# Altium project PIC12F675_prt.PrjPcb
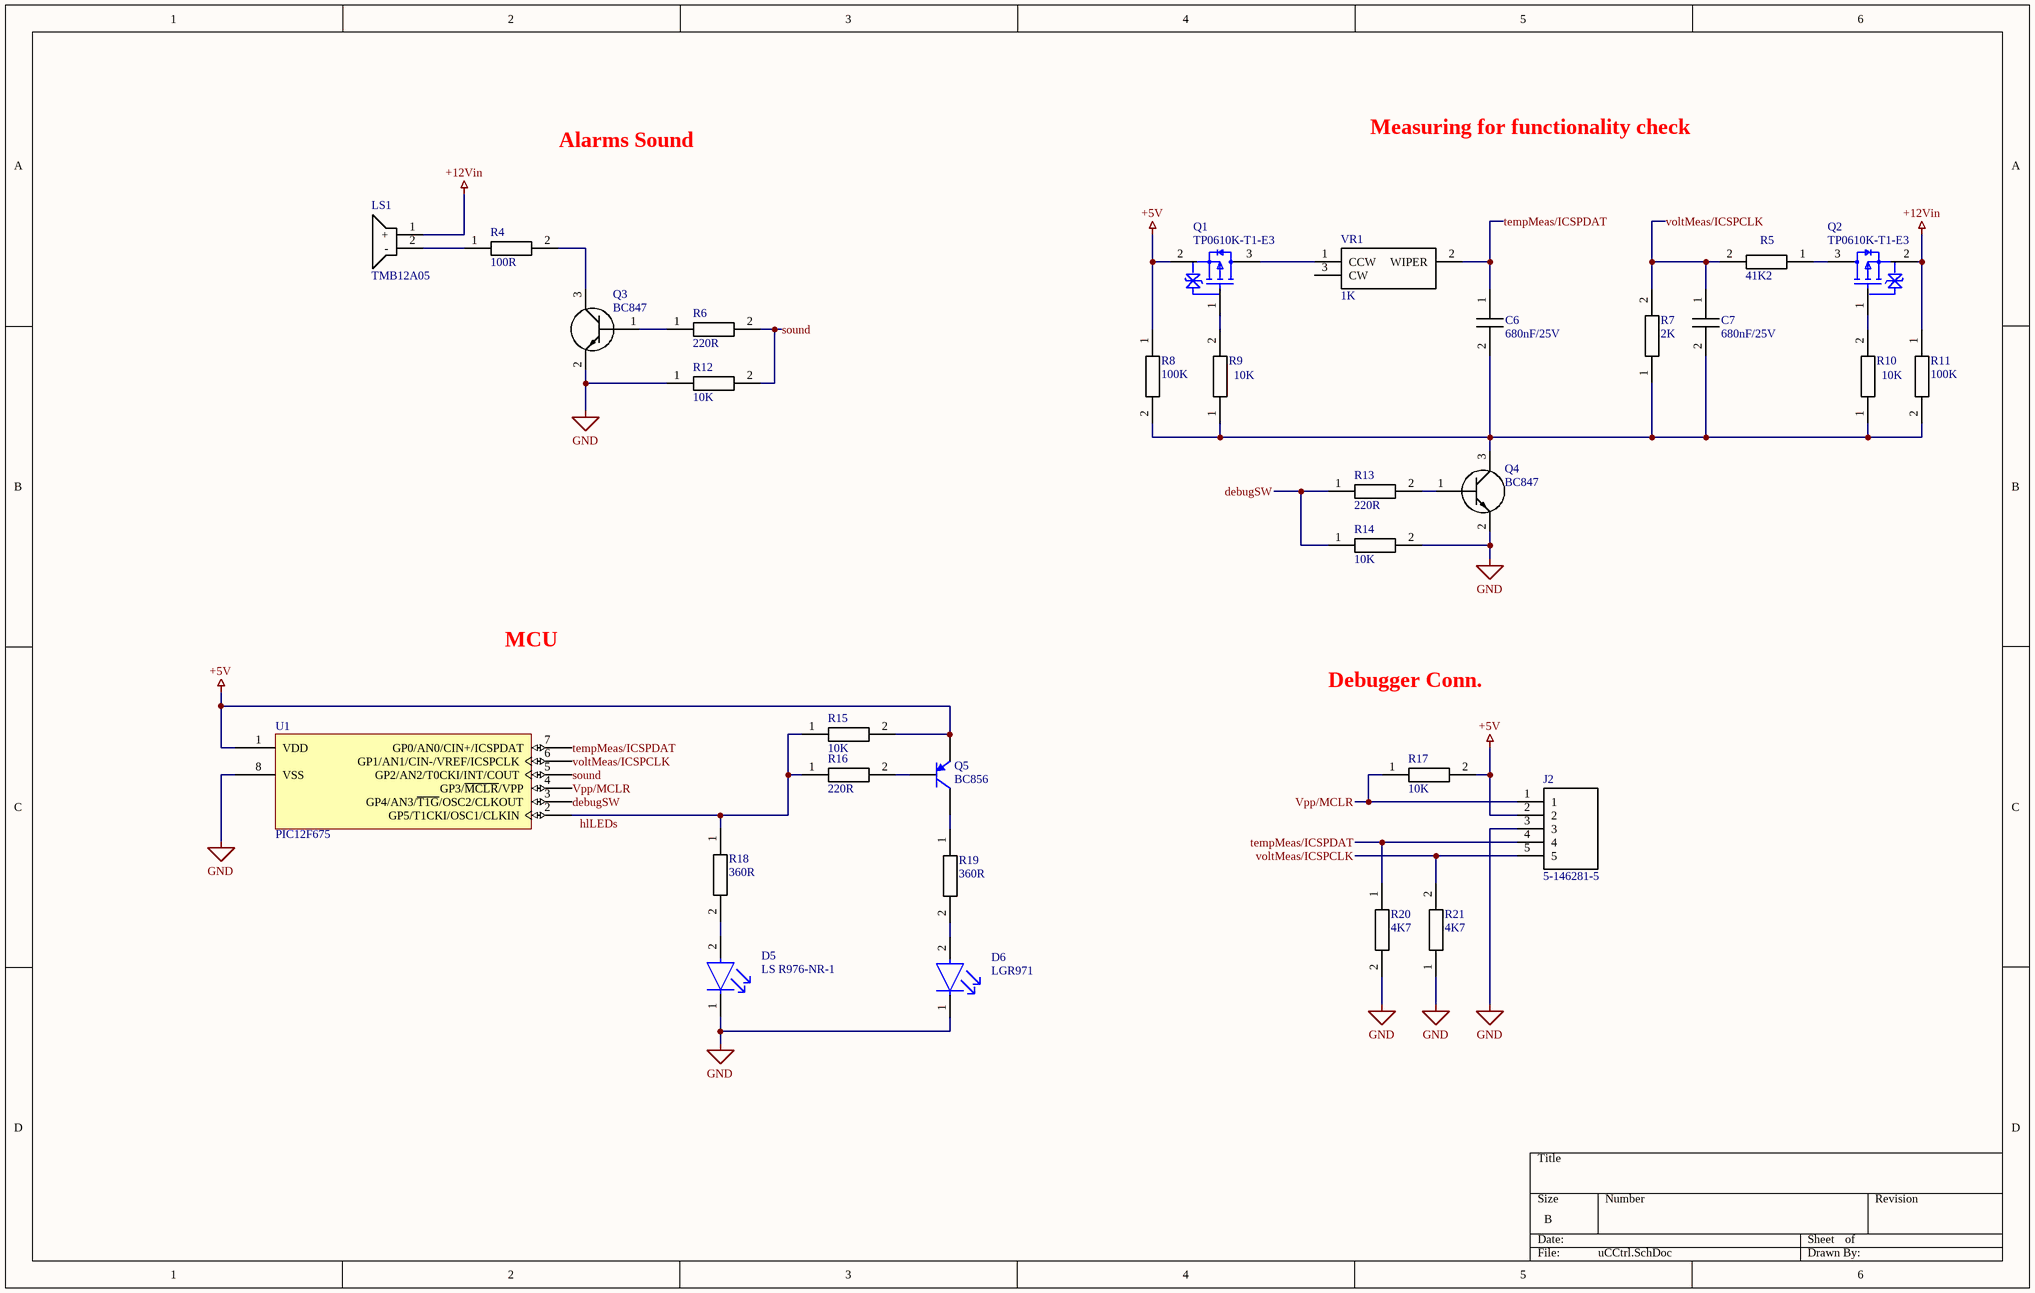
[diagram p0: uCCtrl.SchDoc]
2 sheets, 87 parts. Net scope: global (net labels, ports and power ports of the same name join across sheets).
Board file: Prototype v2.PcbDoc
Sheets:
  uCCtrl.SchDoc
  Filter.SchDoc

## Sheet uCCtrl.SchDoc
size B

### Parts
C6  680nF/25V  [CAPC2012X95N]
C7  680nF/25V  [CAPC2012X95N]
D5  LS R976-NR-1  [FP-LS_R976-MFG]
D6  LGR971  [FP-LG_R971-MFG]
J2  5-146281-5  [HDRV5W67P0X254_1X5_1229X234X821P]
LS1  TMB12A05  [TMB12A05]
Q1  TP0610K-T1-E3  [FP-S-03946-MFG]
Q2  TP0610K-T1-E3  [FP-S-03946-MFG]
Q3  BC847  [BC847215]
Q4  BC847  [BC847215]
Q5  BC856  [NXP-SOT23-3_V]
R4  100R  [RESC2012X60N]
R5  41K2  [RESC2012X65N]
R6  220R  [RESC2012X65N]
R7  2K  [RESC2012X65N]
R8  100K  [RESC2012X65N]
R9  10K  [RESC2012X65N]
R10  10K  [RESC2012X65N]
R11  100K  [RESC2012X65N]
R12  10K  [RESC2012X65N]
R13  220R  [RESC2012X65N]
R14  10K  [RESC2012X65N]
R15  10K  [RESC2012X65N]
R16  220R  [RESC2012X65N]
R17  10K  [RESC2012X65N]
R18  360R  [RESC2012X65N]
R19  360R  [RESC2012X65N]
R20  4K7  [RESC2012X65N]
R21  4K7  [RESC2012X65N]
U1  PIC12F675  [PDIP300-P8]
VR1  1K  [23SR1KLFTR]

### Nets
+5V: J2.2 Q1.2(S) Q5.2(E) R8.1 R15.2 R17.2 U1.1(VDD)
+12Vin: LS1.1(+) Q2.2(S) R11.1
GND: D5.1(C) D6.1(C) J2.3 Q3.2(E) Q4.2(E) R12.1 R14.2 R20.2 R21.1 U1.8(VSS)
debugSW: R13.1 R14.1 U1.3(GP4/AN3/~{T1G}/OSC2/CLKOUT)
hlLEDs: R15.1 R16.1 R18.1 U1.2(GP5/T1CKI/OSC1/CLKIN)
sound: R6.2 R12.2 U1.5(GP2/AN2/T0CKI/INT/COUT)
tempMeas/ICSPDAT: C6.1 J2.4 R20.1 U1.7(GP0/AN0/CIN+/ICSPDAT) VR1.2(WIPER)
voltMeas/ICSPCLK: C7.1 J2.5 R5.2 R7.2 R21.2 U1.6(GP1/AN1/CIN-/VREF/ICSPCLK)
Vpp/MCLR: J2.1 R17.1 U1.4(GP3/~{MCLR}/VPP)
NetC6_2: C6.2 C7.2 Q4.3(C) R7.1 R8.2 R9.1 R10.1 R11.2
NetD5_2: D5.2(A) R18.2
NetD6_2: D6.2(A) R19.2
NetLS1_2: LS1.2(-) R4.1
NetQ1_1: Q1.1(G) R9.2
NetQ1_3: Q1.3(D) VR1.1(CCW)
NetQ2_1: Q2.1(G) R10.2
NetQ2_3: Q2.3(D) R5.1
NetQ3_1: Q3.1(B) R6.1
NetQ3_3: Q3.3(C) R4.2
NetQ4_1: Q4.1(B) R13.2
NetQ5_1: Q5.1(B) R16.2
NetQ5_3: Q5.3(C) R19.1

Not connected (* = marked no-connect by the designer): VR1 3(CW)

### Notes on the sheet
- Alarms Sound
- Measuring for functionality check
- MCU
- Debugger Conn.

### Library data of the parts
C6 C7 = GRM219B31E684KA88D: Capacitor; Manufacturer_Name: Murata Electronics; Datasheet Link: http://www.murata.com/~/media/webrenewal/support/library/catalog/products/capacitor/mlcc/c02e.pdf; Height: 0.95mm; Manufacturer_Part_Number: GRM219B31E684KA88D
D5 = CMP-62016-000037-1: LED RED DIFFUSED 0805 SMD; Lens Size: 1.25mm; Number of LEDs: 1; Luminous Intensity: 180mcd; Dominant Wavelength: 633nm; Lens Style: Flat; Reverse Voltage: 12V; Lens Color: White; Forward Voltage: 2.5V; Forward Current: 25mA; Power Dissipation: 65W; Luminous Flux: 0.47lm; Test Current: 20mA; Viewing Angle: 160°; Length: 2mm; Number of Pins: 2; Lens Transparency: Diffused; Min Operating Temperature: -30°C; Case Code (Metric): 2012; Depth: 1.35mm; Color: Red; Illumination Color: Red; Max Operating Temperature: 85°C; Mount: Surface Mount; Case/Package: 0805; Height: 0.9mm; Package Quantity: 16000; Number of Elements: 1; Radiation Hardening: No; Case Code (Imperial): 0805; Packaging: Tape and Reel; Width: 1.25mm
D6 = CMP-62016-000039-1: LED GREEN DIFFUSED 0805 SMD; Test Current: 20mA; Power Dissipation: 65mW; Number of LEDs: 1; Viewing Angle: 160°; Lens Color: White; Lens Size: 1.25mm; Forward Voltage: 2.2V; Reverse Voltage: 12V; Forward Current: 25mA; Luminous Intensity: 45mcd; Luminous Flux: 0.1lm; Dominant Wavelength: 570nm; Min Operating Temperature: -30°C; Packaging: Tape and Reel; Radiation Hardening: No; Number of Pins: 2; Case Code (Imperial): 0805; Lens Style: Diffused; Mount: Surface Mount; Package Quantity: 1; Case Code (Metric): 2012; Color: Green; Case/Package: 0805; Width: 1.25mm; Illumination Color: Green; Lens Transparency: Diffused; Max Operating Temperature: 85°C; Number of Elements: 1; Depth: 1.35mm; Height: 0.9mm; Length: 2.1mm
J2 = 5-146281-5: Connector; Manufacturer_Name: TE Connectivity; Datasheet Link: https://www.te.com/commerce/DocumentDelivery/DDEController?Action=showdoc&DocId=Customer+Drawing%7F146281%7FG2%7Fpdf%7FEnglish%7FENG_CD_146281_G2.pdf%7F5-146281-5; Height: 8.21mm; Manufacturer_Part_Number: 5-146281-5; Mouser Part Number: 571-5-146281-5; Mouser Price/Stock: https://www.mouser.co.uk/ProductDetail/TE-Connectivity/5-146281-5?qs=bwpFY26eRVcDY9brDBVAcw%3D%3D; Arrow Part Number: 5-146281-5; Arrow Price/Stock: https://www.arrow.com/en/products/5-146281-5/te-connectivity?region=nac
LS1 = TMB12A05: Loudspeaker or Buzzer; Manufacturer_Name: Jiangsu Huaneng Elec; Datasheet Link: https://datasheet.lcsc.com/szlcsc/Jiangsu-Huaneng-Elec-TMB12A05_C96093.pdf; Height: 9.5mm; Manufacturer_Part_Number: TMB12A05
Q1 Q2 = CMP-02550-000129-1: MOSFET P-CH 60V 185MA SOT23-3; Manufacturer: Vishay; Drain To Source Voltage: -60V; Depletion Mode: False; Max Junction Temp: +150°C; Threshold Vgs Max: -3V; Rthja Max: 350°C/W; Max Forward Diode Voltage: -1.4V; Gate Charge At Vgs: 1.7nC @ -15V; Power Dissipation: 350mW; Turn Off Delay Time: 35ns; Number Of P Channels: 1; Standoff Height: 0.01mm; Input Capacitace At Vds: 23pF @ -25V; Gate To Source Voltage: 20V; Turn On Delay Time: 20ns; Continuous Drain Current: -185mA; Drain To Source Resistance: 6Ω; Threshold Vgs Min: -1V; Pulse Drain Current: -800mA; Temperature: -55°C to +150°C; Digikey Description: MOSFET P-CH 60V 185MA SOT23-3; Drain To Source Breakdown Voltage: -60V; Category: Trans; Temperature Range High: +150°C; Ipc Land Pattern Name: SOT95P237X100-3; Height: 1.12mm; Temperature Range Low: -55°C; Device Class L3: MOSFETs; Manufacturer Part Number: TP0610K-T1-E3; Number Of Channels: 1; ComponentLink2Description: Datasheet; RoHS: TRUE; Lead Free: Yes; Package: S-03946; Mouser Description: Mosfet; P-ch; Vdss -60V; Rds(on) 10 Ohms; Id -185MA; TO-236 (SOT-23); Pd 350MW; -55DEGC; Automotive: No; Device Class L2: Transistors; Device Class L1: Discrete Semiconductors; Octopart: https://octopart.com/tp0610k-t1-e3-vishay-40944172; ComponentLink2URL: http://www.vishay.com/docs/71411/tp0610k.pdf
Q3 Q4 = BC847,215: Transistor BJT NPN; Manufacturer_Name: Nexperia; Datasheet Link: https://assets.nexperia.com/documents/data-sheet/BC847_SER.pdf; Height: 1.1mm; Manufacturer_Part_Number: BC847,215; Mouser Part Number: 771-BC847215; Mouser Price/Stock: https://www.mouser.co.uk/ProductDetail/Nexperia/BC847215?qs=me8TqzrmIYWROhdFmDauyQ%3D%3D; Arrow Part Number: BC847,215; Arrow Price/Stock: https://www.arrow.com/en/products/bc847215/nexperia?region=nac
Q5 = CMP-2000-05936-1: PNP General Purpose Transistor, 65 V, -65 to 150 degC, 3-Pin SOT23, RoHS; Manufacturer: NXP; No. of Pins: 3; Voltage Vcbo: 80V; Power Dissipation Ptot Max: 250mW; Current Ic hFE: 2mA; Collector Emitter Voltage V(br)ceo: 65V; Hfe Min: 125; Continuous Collector Current Ic Max: 100mA; Gain Bandwidth ft Typ: 150MHz; Transistor Case Style: SOT-23; No. of Transistors: 1; Package Version: 02/2016; SMD Marking: 3D; Gain Bandwidth ft Min: 100MHz; SVHC: NoSVHC(19-Dec-2012); Noise Factor Max: 10dB; Collector Emitter Voltage Vces: -300mV; Operating Temperature Range: -65°Cto+150°C; Datasheet URL: http://www.nxp.com/documents/data_sheet/BC856_BC857_BC858.pdf; Device Marking: BC856; Mounting Technology: SurfaceMount; Package Reference: SOT23-3; Operating Temperature Max: 150°C; Package / Case: SOT-23; DC Current Gain hFE: 125; Current Ic Continuous a Max: 100mA; Power Dissipation Pd: 250mW; Manufacturer URL: http://www.nxp.com/; Termination Type: SMD; Transistor Polarity: PNP; Package URL: http://www.nxp.com/documents/outline_drawing/SOT23.pdf; DC Collector Current: 100mA; Operating Temperature Min: -65°C; Package Description: 3-Pin Small Outline Transistor, Body 1.3 x 2.9 mm, Pitch 0.95 mm; Datasheet Version: 01/2004
R4 = CRCW0805100RFKEAHP: Resistor; Manufacturer_Name: Vishay; Datasheet Link: https://componentsearchengine.com/Datasheets/1/CRCW08051R00FKEAHP.pdf; Height: 0.6mm; Manufacturer_Part_Number: CRCW0805100RFKEAHP; Mouser Part Number: 71-CRCW0805100RFKEAH; Mouser Price/Stock: https://www.mouser.co.uk/ProductDetail/Vishay-Dale/CRCW0805100RFKEAHP?qs=k2%2FDWSARqgHN0DmoUSjg4g%3D%3D; Arrow Part Number: CRCW0805100RFKEAHP; Arrow Price/Stock: https://www.arrow.com/en/products/crcw0805100rfkeahp/vishay?region=nac
R5 = CPF0805B41K2E1: Resistor; Manufacturer_Name: TE Connectivity; Datasheet Link: http://docs-europe.electrocomponents.com/webdocs/13d1/0900766b813d116f.pdf; Height: 0.65mm; Manufacturer_Part_Number: CPF0805B41K2E1
R6 R12-R16 = CPF0805B220RE: Resistor; Manufacturer_Name: TE Connectivity; Datasheet Link: http://docs-europe.electrocomponents.com/webdocs/13d1/0900766b813d116f.pdf; Height: 0.65mm; Manufacturer_Part_Number: CPF0805B220RE
R7-R11 R17-R21 = CPF0805B360RE1: Resistor; Manufacturer_Name: TE Connectivity; Datasheet Link: http://docs-europe.electrocomponents.com/webdocs/13d1/0900766b813d116f.pdf; Height: 0.65mm; Manufacturer_Part_Number: CPF0805B360RE1; Mouser Part Number: 279-CPF0805B360RE1; Mouser Price/Stock: https://www.mouser.co.uk/ProductDetail/TE-Connectivity-Holsworthy/CPF0805B360RE1?qs=iJVBkmKXgrlAzfqD%252B6zqmg%3D%3D
U1 = CMP-0190-00021-1: FLASH-Based 8-Bit CMOS Microcontroller, 10-Bit A/D, 8-Pin PDIP, Industrial Temperature; Note1: Refer to data sheet (DS41190F) for details of supply voltage range under different conditions.; DatasheetVersion: revF, Sep-2009; Code_JEDEC: MS-001; PackageVersion: revBB, Aug-2009; PackageDescription: 8-Lead Plastic Dual In-Line (P) - 300 mil Body [PDIP]; PackageReference: PDIP300-P8
VR1 = 23SR1KLFTR: Variable Resistor; Manufacturer_Name: TT Electronics; Datasheet Link: https://www.mouser.com/datasheet/2/414/23-1527241.pdf; Height: 2.73mm; Manufacturer_Part_Number: 23SR1KLFTR

## Sheet Filter.SchDoc
size B
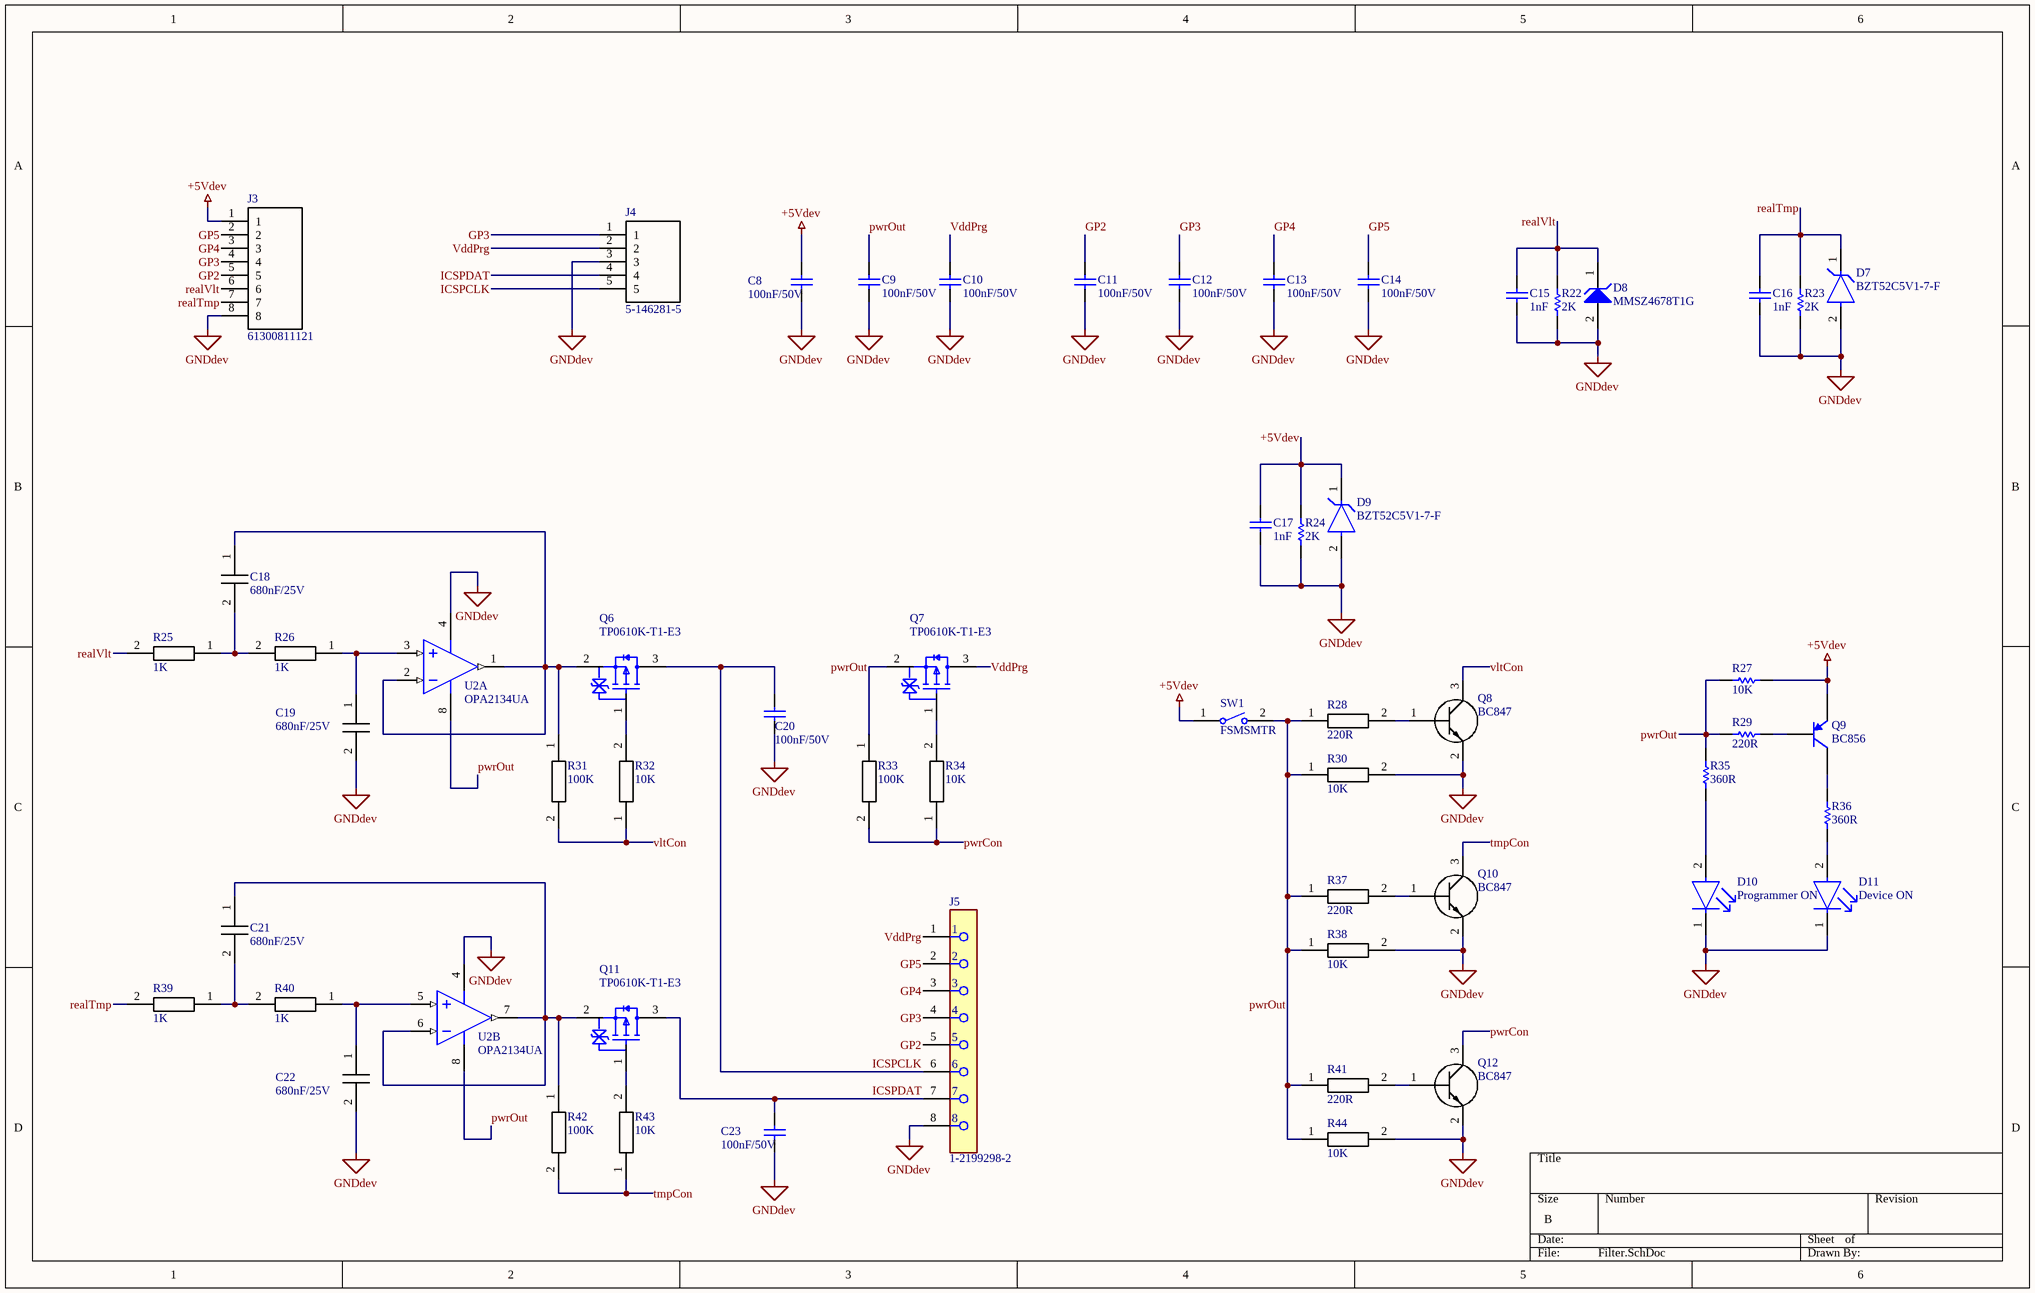
[diagram p1: Filter.SchDoc]

### Parts
C8  100nF/50V  [CAPC2013X145X48NL20T23]
C9  100nF/50V  [CAPC2013X145X48NL20T23]
C10  100nF/50V  [CAPC2013X145X48NL20T23]
C11  100nF/50V  [CAPC2013X145X48NL20T23]
C12  100nF/50V  [CAPC2013X145X48NL20T23]
C13  100nF/50V  [CAPC2013X145X48NL20T23]
C14  100nF/50V  [CAPC2013X145X48NL20T23]
C15  1nF  [CAPC2013X145X48ML20T23]
C16  1nF  [CAPC2013X145X48ML20T23]
C17  1nF  [CAPC2013X145X48ML20T23]
C18  680nF/25V  [CAPC2012X95N]
C19  680nF/25V  [CAPC2012X95N]
C20  100nF/50V  [CAPC2013X145X48NL20T23]
C21  680nF/25V  [CAPC2012X95N]
C22  680nF/25V  [CAPC2012X95N]
C23  100nF/50V  [CAPC2013X145X48NL20T23]
D7  BZT52C5V1-7-F  [FP-SOD123-MFG]
D8  MMSZ4678T1G  [ONSC-SOD-123-2-425-04_V]
D9  BZT52C5V1-7-F  [FP-SOD123-MFG]
D10  Programmer ON  [FP-LG_R971-MFG]
D11  Device ON  [FP-LS_R976-MFG]
J3  61300811121  [HDRV8W64P0X254_1X8_2032X254X854P]
J4  5-146281-5  [HDRV5W67P0X254_1X5_1229X234X821P]
J5  1-2199298-2  [FP-1-2199298-2-MFG]
Q6  TP0610K-T1-E3  [FP-S-03946-MFG]
Q7  TP0610K-T1-E3  [FP-S-03946-MFG]
Q8  BC847  [BC847215]
Q9  BC856  [NXP-SOT23-3_V]
Q10  BC847  [BC847215]
Q11  TP0610K-T1-E3  [FP-S-03946-MFG]
Q12  BC847  [BC847215]
R22  2K  [RESC2013X55X40NL15T20]
R23  2K  [RESC2013X55X40NL15T20]
R24  2K  [RESC2013X55X40NL15T20]
R25  1K  [RESC2012X65N]
R26  1K  [RESC2012X65N]
R27  10K  [RESC2013X55X40NL15T20]
R28  220R  [RESC2012X65N]
R29  220R  [RESC2013X55X40NL15T20]
R30  10K  [RESC2012X65N]
R31  100K  [RESC2012X65N]
R32  10K  [RESC2012X65N]
R33  100K  [RESC2012X65N]
R34  10K  [RESC2012X65N]
R35  360R  [RESC2013X55X40NL15T20]
R36  360R  [RESC2013X55X40NL15T20]
R37  220R  [RESC2012X65N]
R38  10K  [RESC2012X65N]
R39  1K  [RESC2012X65N]
R40  1K  [RESC2012X65N]
R41  220R  [RESC2012X65N]
R42  100K  [RESC2012X65N]
R43  10K  [RESC2012X65N]
R44  10K  [RESC2012X65N]
SW1  FSMSMTR  [TECO-FSMSMTR_V]
U2  OPA2134UA  [D0008A_L]  (parts A,B of 2)

### Nets
+5Vdev: C8.2 C17.2 D9.1(C) J3.1 Q9.2(E) R24.2 R27.1 SW1.1
GNDdev: C8.1 C9.2 C10.2 C11.2 C12.2 C13.2 C14.2 C15.1 C16.1 C17.1 C19.2 C20.1 C22.2 C23.1 D7.2(A) D8.2(A) D9.2(A) D10.1(C) D11.1(C) J3.8 J4.3 J5.8 Q8.2(E) Q10.2(E) Q12.2(E) R22.1 R23.1 R24.1 R30.2 R38.2 R44.2 U2.4(V-)
GP2: C11.1 J3.5 J5.5
GP3: C12.1 J3.4 J4.1 J5.4
GP4: C13.1 J3.3 J5.3
GP5: C14.1 J3.2 J5.2
ICSPCLK: C20.2 J4.5 J5.6 Q6.3(D)
ICSPDAT: C23.2 J4.4 J5.7 Q11.3(D)
pwrCon: Q12.3(C) R33.2 R34.1
pwrOut: C9.1 Q7.2(S) R27.2 R28.1 R29.2 R30.1 R33.1 R35.2 R37.1 R38.1 R41.1 R44.1 SW1.2 U2.8(V+)
realTmp: C16.2 D7.1(C) J3.7 R23.2 R39.2
realVlt: C15.2 D8.1(K) J3.6 R22.2 R25.2
tmpCon: Q10.3(C) R42.2 R43.1
VddPrg: C10.1 J4.2 J5.1 Q7.3(D)
vltCon: Q8.3(C) R31.2 R32.1
NetC18_1: C18.1 Q6.2(S) R31.1 U2.1(OUT_A) U2.2(IN_A-)
NetC18_2: C18.2 R25.1 R26.2
NetC19_1: C19.1 R26.1 U2.3(IN_A+)
NetC21_1: C21.1 Q11.2(S) R42.1 U2.6(IN_B-) U2.7(OUT_B)
NetC21_2: C21.2 R39.1 R40.2
NetC22_1: C22.1 R40.1 U2.5(IN_B+)
NetD10_2: D10.2(A) R35.1
NetD11_2: D11.2(A) R36.1
NetQ6_1: Q6.1(G) R32.2
NetQ7_1: Q7.1(G) R34.2
NetQ8_1: Q8.1(B) R28.2
NetQ9_1: Q9.1(B) R29.1
NetQ9_3: Q9.3(C) R36.2
NetQ10_1: Q10.1(B) R37.2
NetQ11_1: Q11.1(G) R43.2
NetQ12_1: Q12.1(B) R41.2

### Library data of the parts
C8-C14 C20 C23 = CMP-2007-03167-1: Manufacturer: Vitramon; Part Number: VJ0805Y104KNAAT
C15-C17 = CMP-2007-03154-1: Part Number: VJ0805Y102KXAMC; Manufacturer: Vitramon
C18 C19 C21 C22 = GRM219B31E684KA88D: as C6 on sheet uCCtrl; Datasheet Link: http://www.murata.com/~/media/webrenewal/support/library/catalog/products/capacitor/mlcc/c02e.pdf; Height: 0.95mm; Manufacturer_Part_Number: GRM219B31E684KA88D
D7 D9 = CMP-2000-05976-2: DIODE ZENER 5.1V 500MW SOD123; Manufacturer: Diodes Incorporated; Standoff Height: 0mm; Max Reverse Leakage Current: 2uA; Forward Current: 10mA; Power Dissipation: 370mW; Max Zener Voltage: 5.4V; Zener Impedance: 60Ω; Automotive Grade: NA; Max Junction Temp: +150°C; Device Class L3: Zener Diodes; ComponentLink2Description: Datasheet; Manufacturer Part Number: BZT52C5V1-7-F; Mouser Description: Zener Diodes 5.1V 500mW; Octopart: https://octopart.com/bzt52c5v1-7-f-diodes+inc.-326718; Package: SOD123; RoHS: TRUE; Nom Zener Voltage: 5.1V; Device Class L1: Discrete Semiconductors; Lead Free: Yes; Footprint Url: https://www.diodes.com/assets/Package-Files/SOD123.pdf; ComponentLink2URL: https://www.diodes.com/assets/Datasheets/ds18004.pdf; Digikey Description: DIODE ZENER 5.1V 500MW SOD123; Height: 1.45mm; Temperature Range Low: -65°C; Device Class L2: Diodes; Temperature: -65°C to +150°C; Automotive: No; Temperature Range High: +150°C; Category: Diode
D8 = CMP-1060-00511-1: Zener Voltage Regulator, 500 mW, 2-Pin SOD-123, Pb-Free, Tape and Reel; Manufacturer: On Semiconductor; P Max (W): 0.5; VZ Typ (V): 1.8; PackageDescription: 2-Pin SOD, Body 1.6 x 2.69 mm; ComponentLink3Description: Package Specification; PackageReference: SOD-123-2-425-04; RoHS: Pb-Free; PackageVersion: Rev. G, 10/2009; Packing: Tape and Reel; ComponentLink1URL: http://www.onsemi.com/; ComponentLink2Description: Datasheet; ComponentLink3URL: http://www.onsemi.com/pub_link/Collateral/425-04.PDF; ComponentLink2URL: http://www.onsemi.com/pub_link/Collateral/MMSZ4678T1-D.PDF; DatasheetVersion: Rev. 9; ComponentLink1Description: Manufacturer URL; Mounting Technology: Surface Mount; PartNumber: MMSZ4678T1G
D10 = CMP-62016-000039-1: as D6 on sheet uCCtrl; Min Operating Temperature: -30°C; Packaging: Tape and Reel; Radiation Hardening: No; Number of Pins: 2; Case Code (Imperial): 0805; Lens Style: Diffused; Mount: Surface Mount; Package Quantity: 1; Case Code (Metric): 2012; Color: Green; Case/Package: 0805; Width: 1.25mm; Illumination Color: Green; Lens Transparency: Diffused; Max Operating Temperature: 85°C; Number of Elements: 1; Depth: 1.35mm; Height: 0.9mm; Length: 2.1mm
D11 = CMP-62016-000037-1: as D5 on sheet uCCtrl; Length: 2mm; Number of Pins: 2; Lens Transparency: Diffused; Min Operating Temperature: -30°C; Case Code (Metric): 2012; Depth: 1.35mm; Color: Red; Illumination Color: Red; Max Operating Temperature: 85°C; Mount: Surface Mount; Case/Package: 0805; Height: 0.9mm; Package Quantity: 16000; Number of Elements: 1; Radiation Hardening: No; Case Code (Imperial): 0805; Packaging: Tape and Reel; Width: 1.25mm
J3 = 61300811121: Connector; Manufacturer_Name: Wurth Elektronik; Datasheet Link: http://katalog.we-online.de/em/datasheet/6130xx11121.pdf; Height: 8.54mm; Manufacturer_Part_Number: 61300811121; Mouser Part Number: 710-61300811121; Mouser Price/Stock: https://www.mouser.co.uk/ProductDetail/Wurth-Elektronik/61300811121?qs=PhR8RmCirEZRdx%252BVlEmRRA%3D%3D
J4 = 5-146281-5: as J2 on sheet uCCtrl; Datasheet Link: https://www.te.com/commerce/DocumentDelivery/DDEController?Action=showdoc&DocId=Customer+Drawing%7F146281%7FG2%7Fpdf%7FEnglish%7FENG_CD_146281_G2.pdf%7F5-146281-5; Height: 8.21mm; Manufacturer_Part_Number: 5-146281-5; Mouser Part Number: 571-5-146281-5; Mouser Price/Stock: https://www.mouser.co.uk/ProductDetail/TE-Connectivity/5-146281-5?qs=bwpFY26eRVcDY9brDBVAcw%3D%3D; Arrow Part Number: 5-146281-5; Arrow Price/Stock: https://www.arrow.com/en/products/5-146281-5/te-connectivity?region=nac
J5 = CMP-03370-000009-1: CONN IC DIP SOCKET 8POS TIN; Contact Post Length: 3inch; Number of Contacts: 8; Contact Current Rating: 1A; Contact Resistance: 20mR; Insulation Resistance: 1GR; Connector Type: Pin; Row Spacing: 0.3inch; Pitch: 2.54mm; Mating Alignment: Yes (With); RoHS Compliant: Yes; Packaging: Rail/Tube; Contact Material: Bronze; Lead Pitch: 2.54mm; Mount: Through Hole; Termination: Through Hole; Max Operating Temperature: 105°C; Flammability Rating: UL94 V-0; Package Quantity: 60; Contact Finish - Mating: TIN; ELV: Compliant; Radiation Hardening: No; Number of Rows: 2; Series: Diplomate DL; Color: Black; Number of Positions: 8; Contact Plating: Tin; Min Operating Temperature: -40°C; Lead Free: Lead Free; Length: 0.4inch; Orientation: Straight; Housing Material: PBT
Q6 Q7 Q11 = CMP-02550-000129-1: as Q1 on sheet uCCtrl; Temperature: -55°C to +150°C; Digikey Description: MOSFET P-CH 60V 185MA SOT23-3; Drain To Source Breakdown Voltage: -60V; Category: Trans; Temperature Range High: +150°C; Ipc Land Pattern Name: SOT95P237X100-3; Height: 1.12mm; Temperature Range Low: -55°C; Device Class L3: MOSFETs; Manufacturer Part Number: TP0610K-T1-E3; Number Of Channels: 1; ComponentLink2Description: Datasheet; RoHS: TRUE; Lead Free: Yes; Package: S-03946; Mouser Description: Mosfet; P-ch; Vdss -60V; Rds(on) 10 Ohms; Id -185MA; TO-236 (SOT-23); Pd 350MW; -55DEGC; Automotive: No; Device Class L2: Transistors; Device Class L1: Discrete Semiconductors; Octopart: https://octopart.com/tp0610k-t1-e3-vishay-40944172; ComponentLink2URL: http://www.vishay.com/docs/71411/tp0610k.pdf
Q8 Q10 Q12 = BC847,215: as Q3 on sheet uCCtrl; Datasheet Link: https://assets.nexperia.com/documents/data-sheet/BC847_SER.pdf; Height: 1.1mm; Manufacturer_Part_Number: BC847,215; Mouser Part Number: 771-BC847215; Mouser Price/Stock: https://www.mouser.co.uk/ProductDetail/Nexperia/BC847215?qs=me8TqzrmIYWROhdFmDauyQ%3D%3D; Arrow Part Number: BC847,215; Arrow Price/Stock: https://www.arrow.com/en/products/bc847215/nexperia?region=nac
Q9 = CMP-2000-05936-1: as Q5 on sheet uCCtrl; Operating Temperature Range: -65°Cto+150°C; Datasheet URL: http://www.nxp.com/documents/data_sheet/BC856_BC857_BC858.pdf; Device Marking: BC856; Mounting Technology: SurfaceMount; Package Reference: SOT23-3; Operating Temperature Max: 150°C; Package / Case: SOT-23; DC Current Gain hFE: 125; Current Ic Continuous a Max: 100mA; Power Dissipation Pd: 250mW; Manufacturer URL: http://www.nxp.com/; Termination Type: SMD; Transistor Polarity: PNP; Package URL: http://www.nxp.com/documents/outline_drawing/SOT23.pdf; DC Collector Current: 100mA; Operating Temperature Min: -65°C; Package Description: 3-Pin Small Outline Transistor, Body 1.3 x 2.9 mm, Pitch 0.95 mm; Datasheet Version: 01/2004
R22-R24 R27 R29 R35 R36 = CMP-2001-04755-1: Manufacturer: Vishay Dale; Part Number: TNPW08052K00BEEN
R25 R26 R31-R34 R39 R40 R42 R43 = CPF0805B360RE1: as R7 on sheet uCCtrl; Datasheet Link: http://docs-europe.electrocomponents.com/webdocs/13d1/0900766b813d116f.pdf; Height: 0.65mm; Manufacturer_Part_Number: CPF0805B360RE1; Mouser Part Number: 279-CPF0805B360RE1; Mouser Price/Stock: https://www.mouser.co.uk/ProductDetail/TE-Connectivity-Holsworthy/CPF0805B360RE1?qs=iJVBkmKXgrlAzfqD%252B6zqmg%3D%3D
R28 R30 R37 R38 R41 R44 = CPF0805B220RE: as R6 on sheet uCCtrl; Datasheet Link: http://docs-europe.electrocomponents.com/webdocs/13d1/0900766b813d116f.pdf; Height: 0.65mm; Manufacturer_Part_Number: CPF0805B220RE
SW1 = CMP-2000-07501-1: FSMSM Push Button Switch, 50 mA, -35 to 85 degC, 2-Pin SMD, RoHS, Tape and Reel; Manufacturer: TE Connectivity; Voltage Rating (DC): 24V; Electrical Life: 20000Cycles; Operating Force: 180gf; Switch Travel: 0.25mm; Contact Current Rating: 50mA; Case\/Package: SMD/SMT; Actuator Length: 1.07mm; Throw Configuration: SPST; Actuator Material: Polyamide; Contact Resistance: 100mOhm; Illumination Type: Illuminated; Max Voltage Rating (DC): 12V; Manufacturer URL: http://www.te.com/; Lead Free: LeadFree; Packaging: TapeandReel; Min Operating Temperature: -35degC; Mechanical Life: 20000Cycles; Mount: SurfaceMount; REACH SVHC: Unknown; Package Quantity: 1800; Package Reference: FSMSMTR; RoHSCompliant: true; Max Operating Temperature: 85degC; Orientation: Straight; ELV: Compliant; Datasheet URL: http://www.te.com/commerce/DocumentDelivery/DDEController?Action=showdoc&DocId=Customer+Drawing%7F1437566-3%7FC2%7Fpdf%7FEnglish%7FENG_CD_1437566-3_C2_1437566_3_1_c.dwg.pdf%7F1437566-4; Package Description: 2-Pin Surface Mount Device, Body 6 x 3.5 mm, Pitch 9.19 mm; Current Rating: 50mA; Contact Plating: Silver; Termination: GullWing; Datasheet Version: Rev. C2, 08/2014; Contact Material: Brass; Mounting Technology: SurfaceMount
U2 = CMP-0808-00034-2: SoundPlus(TM) High Performance Audio Operational Amplifier, 5 to 36 V, -40 to 125 degC, 8-pin SOIC (D8), Green (RoHS & no Sb/Br); Manufacturer: Texas Instruments; Vmin(V): 5; Vmax(V): 36; Number of Channels: 2; GBW(Typ)(MHz): 8; DatasheetVersion: SBOS058; Code_JEDEC: MS-012; PackageDescription: 8-Pin Plastic Small Outline, Body 4.9 x 3.9 mm, Pitch 1.27 mm; Mounting Technology: Surface Mount; ComponentLink3Description: Package Specification; Eco-Plan: Green (RoHS & no Sb/Br); SubFamily: Audio Operational Amplifier; ComponentLink3URL: http://www.ti.com/litv/pdf/msoi002j; ComponentLink2URL: http://www.ti.com/general/docs/lit/getliterature.tsp?genericPartNumber=OPA2134&fileType=pdf; Iq per channel(Max)(mA): 5; ComponentLink1Description: Manufacturer URL; PartNumber: OPA2134UA; PackageReference: D0008A; ComponentLink1URL: http://www.ti.com/; PackageVersion: 4040047-3/M, 06/2011; ComponentLink2Description: Datasheet; Vn at Flatband(Typ)(nV/rtHz): 8